# Altium schematic sheet MCUs.SchDoc
size B; Organization: ORGANIZATION; Address1: ADDRESS 1; Address2: ADDRESS 2; Address3: ADDRESS 3; Address4: ADDRESS 4; Revision: -; SheetNumber: 2; SheetTotal: 7; ENG_APP_DATE: --/--/--; DSN_APP_DATE: --/--/--; CHK_APP_DATE: --/--/--
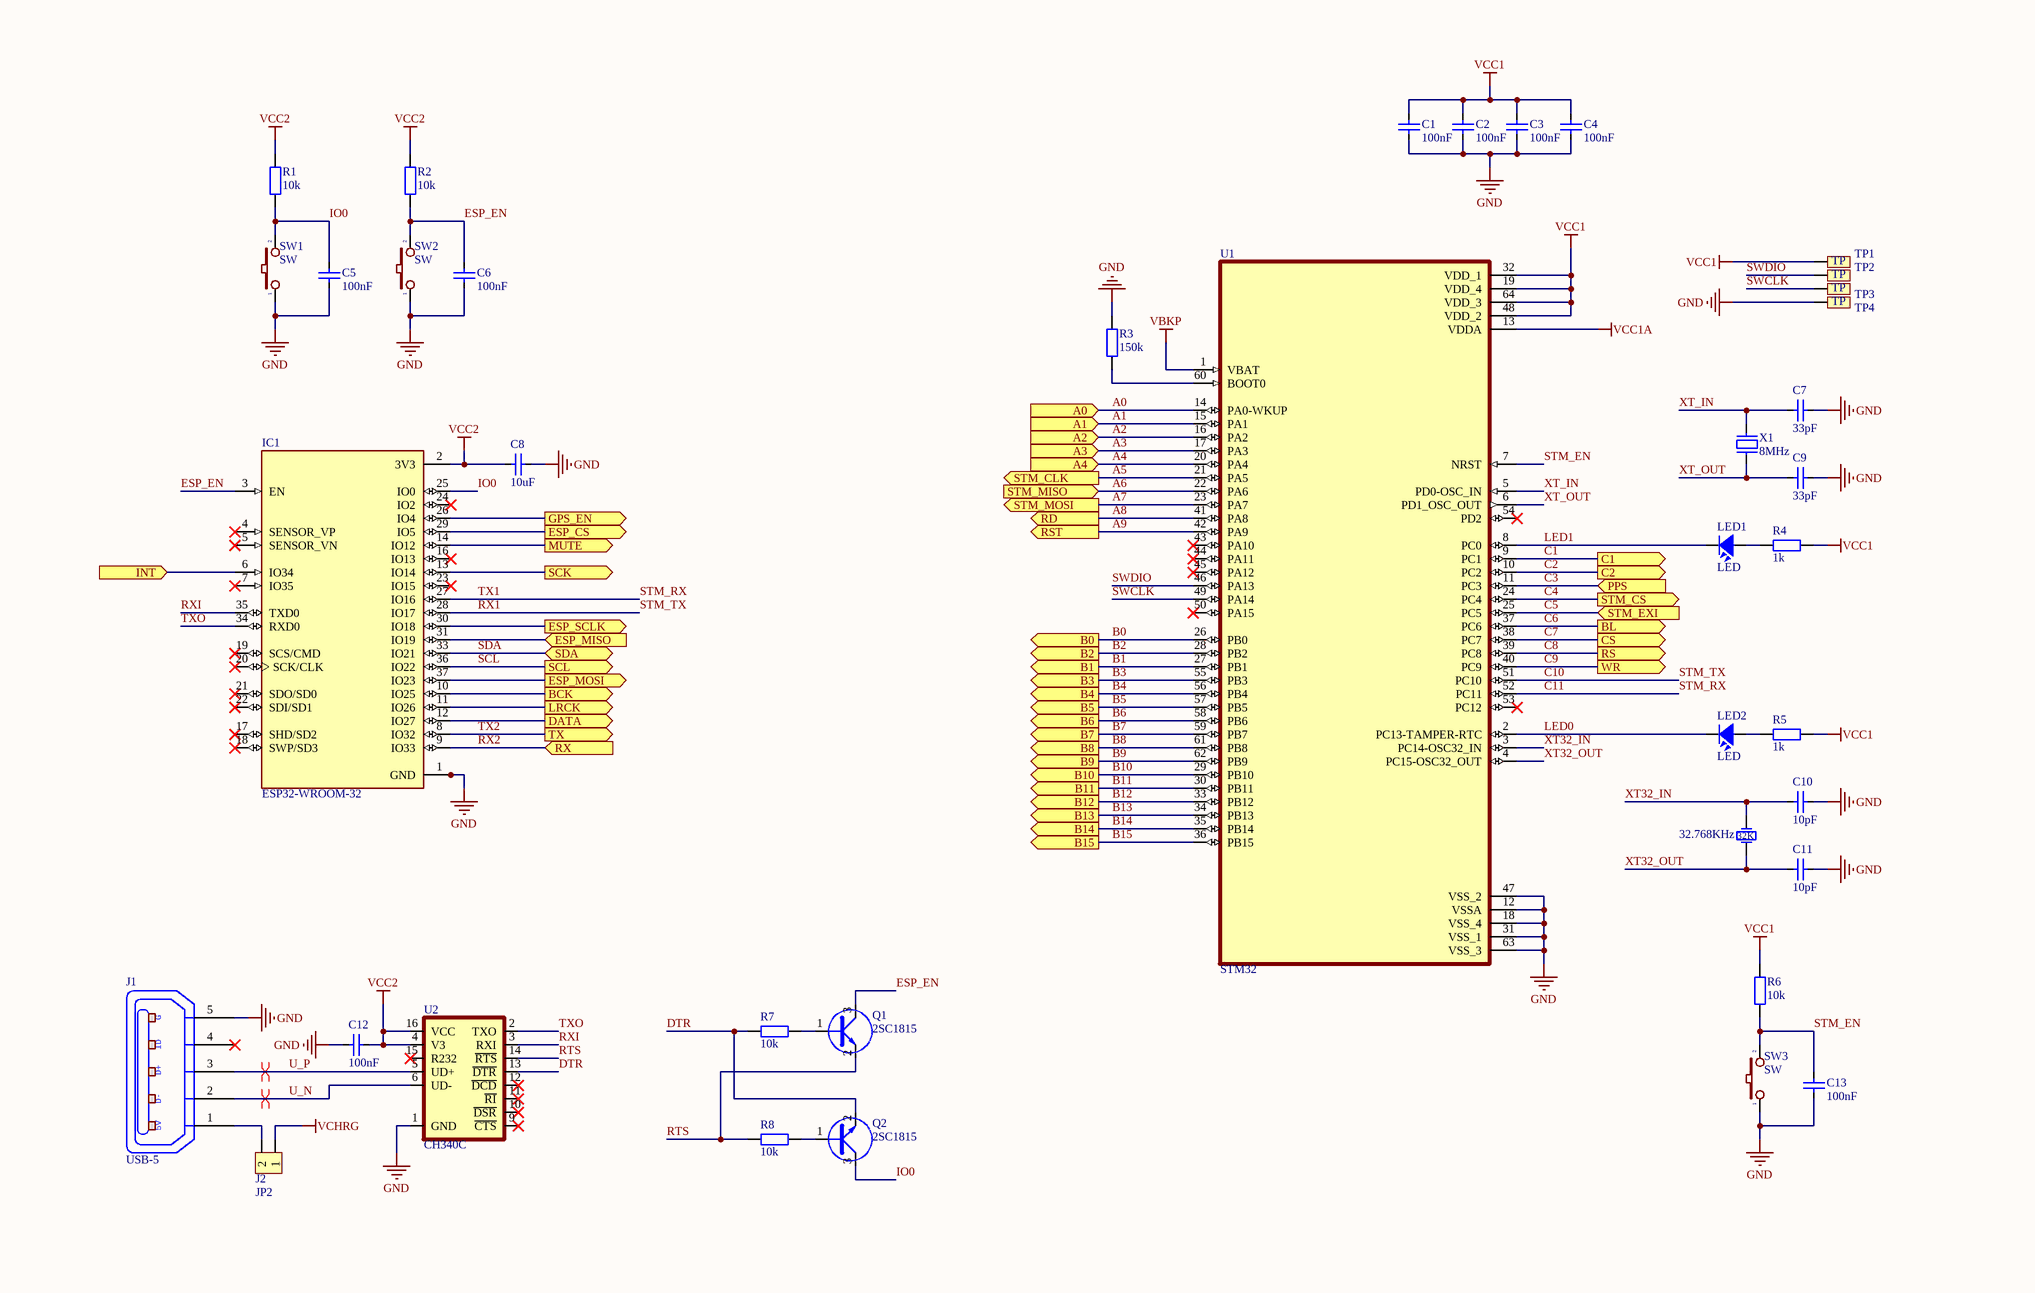
[diagram p0: MCUs.SchDoc]

## Parts
C1  100nF  [CAP_0603]
C2  100nF  [CAP_0603]
C3  100nF  [CAP_0603]
C4  100nF  [CAP_0603]
C5  100nF  [CAP_0603]
C6  100nF  [CAP_0603]
C7  33pF  [CAP_0603]
C8  10uF  [CAP_0603]
C9  33pF  [CAP_0603]
C10  10pF  [CAP_0603]
C11  10pF  [CAP_0603]
C12  100nF  [CAP_0603]
C13  100nF  [CAP_0603]
IC1  ESP32-WROOM-32  [MODULE_ESP32-WROOM-32]
J1  USB-5  [USB-M1]
J2  JP2  [JP2-CLOSED]
LED1  LED  [LED-0805-Blue]
LED2  LED  [LED-0805-Green]
Q1  2SC1815  [SOT23D]
Q2  2SC1815  [SOT23D]
R1  10k  [RES-SMD-0603]
R2  10k  [RES-SMD-0603]
R3  150k  [RES-SMD-0603]
R4  1k  [RES-SMD-0603]
R5  1k  [RES-SMD-0603]
R6  10k  [RES-SMD-0603]
R7  10k  [RES-SMD-0603]
R8  10k  [RES-SMD-0603]
SW1  SW  [SW 3x2x4]
SW2  SW  [SW 3x2x4]
SW3  SW  [SW 3x2x4]
TP1  TP  [TP_SMD]  (value not drawn)
TP2  TP  [TP_SMD]  (value not drawn)
TP3  TP  [TP_SMD]  (value not drawn)
TP4  TP  [TP_SMD]  (value not drawn)
U1  STM32  [LQFP 64]
U2  CH340C  [SOP-16]
X1  8MHz  [XT2]
Y1  32.768KHz  [XTAL32K]

## Ports
A0 (in), A1 (in), A2 (in), A3 (in), A4 (in), B0 (out), B1 (out), B2 (out), B3 (out), B4 (out), B5 (out), B6 (out), B7 (out), B8 (out), B9 (out), B10 (out), B11 (out), B12 (out), B13 (out), B14 (out), B15 (out), BCK (out), BL (out), C1 (out), C2 (out), CS (out), DATA (out), ESP_CS (out), ESP_MISO (in), ESP_MOSI (out), ESP_SCLK (out), GPS_EN (out), INT (in), LRCK (out), MUTE (out), PPS (in), RD (out), RS (out), RST (out), RX (in), SCK (out), SCL (out), SDA (bidir), STM_CLK (out), STM_CS (out), STM_EXI (in), STM_MISO (in), STM_MOSI (out), TX (out), WR (out)

## Nets
GND: C1.2 C2.2 C3.2 C4.2 C5.2 C6.2 C7.1 C8.2 C9.1 C10.1 C11.1 C12.1 C13.2 IC1.1(GND) IC1.15(GND) IC1.38(GND) IC1.39_1(GND) IC1.39_2(GND) IC1.39_3(GND) IC1.39_4(GND) IC1.39_5(GND) IC1.39_6(GND) IC1.39_7(GND) IC1.39_8(GND) IC1.39_9(GND) IC1.39_10(GND) IC1.39_11(GND) IC1.39_12(GND) IC1.39_13(GND) IC1.39_14(GND) IC1.39_15(GND) IC1.39_16(GND) IC1.39_17(GND) IC1.39_18(GND) IC1.39_19(GND) IC1.39_20(GND) IC1.39_21(GND) J1.5(P5) R3.1 SW1.1 SW2.1 SW3.1 TP4.1 U1.12(VSSA) U1.18(VSS_4) U1.31(VSS_1) U1.47(VSS_2) U1.63(VSS_3) U2.1(GND)
VBKP: U1.1(VBAT)
VCC1: C1.1 C2.1 C3.1 C4.1 R4.1 R5.1 R6.2 TP1.1 U1.19(VDD_4) U1.32(VDD_1) U1.48(VDD_2) U1.64(VDD_3)
VCC1A: U1.13(VDDA)
VCC2: C8.1 C12.2 IC1.2(3V3) R1.2 R2.2 U2.4(V3) U2.16(VCC)
VCHRG: J2.1
A0: U1.14(PA0-WKUP) ; port A0
A1: U1.15(PA1) ; port A1
A2: U1.16(PA2) ; port A2
A3: U1.17(PA3) ; port A3
A4: U1.20(PA4) ; port A4
A5: U1.21(PA5) ; port STM_CLK
A6: U1.22(PA6) ; port STM_MISO
A7: U1.23(PA7) ; port STM_MOSI
A8: U1.41(PA8) ; port RD
A9: U1.42(PA9) ; port RST
B0: U1.26(PB0) ; port B0
B1: U1.27(PB1) ; port B1
B2: U1.28(PB2) ; port B2
B3: U1.55(PB3) ; port B3
B4: U1.56(PB4) ; port B4
B5: U1.57(PB5) ; port B5
B6: U1.58(PB6) ; port B6
B7: U1.59(PB7) ; port B7
B8: U1.61(PB8) ; port B8
B9: U1.62(PB9) ; port B9
B10: U1.29(PB10) ; port B10
B11: U1.30(PB11) ; port B11
B12: U1.33(PB12) ; port B12
B13: U1.34(PB13) ; port B13
B14: U1.35(PB14) ; port B14
B15: U1.36(PB15) ; port B15
BCK: IC1.10(IO25) ; port BCK
C1: U1.9(PC1) ; port C1
C2: U1.10(PC2) ; port C2
C3: U1.11(PC3) ; port PPS
C4: U1.24(PC4) ; port STM_CS
C5: U1.25(PC5) ; port STM_EXI
C6: U1.37(PC6) ; port BL
C7: U1.38(PC7) ; port CS
C8: U1.39(PC8) ; port RS
C9: U1.40(PC9) ; port WR
C10: IC1.28(IO17) U1.51(PC10)  [also labelled RX1, STM_TX]
C11: IC1.27(IO16) U1.52(PC11)  [also labelled STM_RX, TX1]
DATA: IC1.12(IO27) ; port DATA
DTR: Q2.2(E) R7.2 U2.13(~{DTR})
ESP_CS: IC1.29(IO5) ; port ESP_CS
ESP_EN: C6.1 IC1.3(EN) Q1.3(C) R2.1 SW2.2
ESP_MISO: IC1.31(IO19) ; port ESP_MISO
ESP_MOSI: IC1.37(IO23) ; port ESP_MOSI
ESP_SCLK: IC1.30(IO18) ; port ESP_SCLK
GPS_EN: IC1.26(IO4) ; port GPS_EN
INT: IC1.6(IO34) ; port INT
IO0: C5.1 IC1.25(IO0) Q2.3(C) R1.1 SW1.2
LED0: LED2.2 U1.2(PC13-TAMPER-RTC)
LED1: LED1.2 U1.8(PC0)
LRCK: IC1.11(IO26) ; port LRCK
MUTE: IC1.14(IO12) ; port MUTE
RTS: Q1.2(E) R8.2 U2.14(~{RTS})
RX2: IC1.9(IO33) ; port RX
RXI: IC1.35(TXD0) U2.3(RXI)
SCK: IC1.13(IO14) ; port SCK
SCL: IC1.36(IO22) ; port SCL
SDA: IC1.33(IO21) ; port SDA
STM_EN: C13.1 R6.1 SW3.2 U1.7(NRST)
SWCLK: TP3.1 U1.49(PA14)
SWDIO: TP2.1 U1.46(PA13)
TX2: IC1.8(IO32) ; port TX
TXO: IC1.34(RXD0) U2.2(TXO)
U_N: J1.2(P2) U2.6(UD-)
U_P: J1.3(P3) U2.5(UD+)
XT32_IN: C10.2 U1.3(PC14-OSC32_IN) Y1.1(OSC1)
XT32_OUT: C11.2 U1.4(PC15-OSC32_OUT) Y1.2(OSC2)
XT_IN: C7.2 U1.5(PD0-OSC_IN) X1.2
XT_OUT: C9.2 U1.6(PD1_OSC_OUT) X1.1
NetJ1_1: J1.1(P1) J2.2
NetLED1_1: LED1.1 R4.2
NetLED2_1: LED2.1 R5.2
NetQ1_1: Q1.1(B) R7.1
NetQ2_1: Q2.1(B) R8.1
NetR3_2: R3.2 U1.60(BOOT0)

Not connected (* = marked no-connect by the designer): IC1 4(SENSOR_VP)* 5(SENSOR_VN)* 7(IO35)* 16(IO13)* 17(SHD/SD2)* 18(SWP/SD3)* 19(SCS/CMD)* 20(SCK/CLK)* 21(SDO/SD0)* 22(SDI/SD1)* 23(IO15)* 24(IO2)*; J1 4(P4)*; U1 43(PA10)* 44(PA11)* 45(PA12)* 50(PA15)* 53(PC12)* 54(PD2)*; U2 9(~{CTS})* 10(~{DSR})* 11(~{RI})* 12(~{DCD})* 15(R232)*

## Layout directives
differential pair: U_N, U_P

## Notes on the sheet
- DWG. NO.
- REV.
- SHT.
- THIS DOCUMENT AND THE DATA DISCLOSED HEREIN OR HEREWITH IS THE PROPERTY OF ALTIUM LIMITED AND MAY BE FREELY DISTRIBUTED IN WHOLE. NO RIGHTS ARE RESERVED OR EXPRESS OR IMPLIED WARANTEE GIVEN.
- REVISION
- DESCRIPTION
- DATE
- APPROVED
- ENG:
- APPROVALS
- PROJECT
- DSN:
- CHK:
- REFERENCE DOCUMENTS
- PROJECT REVISION:
- TITLE
- DOCUMENT REVISION:
- DESIGN ITEM:
- BOM:
- FAB DWG:
- PCB DWG:
- ASSY DWG:
- SCALE:
- SIZE
- B
- CAGE CODE
- FILE NAME
- DWG NO.
- SHEET
- OF
- REV
- (in symbol USB-5) G; ID; D+; D-; 5V
- (in symbol XTAL/32KHz) 32K

## Library data of the parts
C1-C13 = CapSMD: Capacitor; Value: 33p; Published: 8-Jun-2000; LatestRevisionDate: 17-Jul-2002; LatestRevisionNote: Re-released for DXP Platform.; PackageReference: RAD-0.3; Publisher: Altium Limited
IC1 = ESP32-WROOM-32: Bluetooth, WiFi Transceiver Module 2.4GHz ~ 2.5GHz Surface Mount; MF: Espressif Systems; Package: Module Espressif Systems; Digi-Key_Part_Number: 1904-1010-1-ND; Digi-Key_Purchase_URL: https://www.digikey.com/product-detail/en/espressif-systems/ESP32-WROOM-32/1904-1010-1-ND/8544305?utm_source=snapeda&utm_medium=aggregator&utm_campaign=symbol; Value: *; MP: ESP32-WROOM-32; SnapEDA_Link: https://www.snapeda.com/parts/ESP32-WROOM-32/Espressif%20Systems/view-part/2753322/?ref=snap
J1 = USB-5: Manufacturer: FCI; Manufacturer Part Number: 10118193-0001LF; Connector Type: USB - micro B; Number of Contacts: 5; Gender: Receptacle; Specifications: USB 2.0; .Creator: MM; .Checked PCB: RF; Supplier 1: Digi-Key; RoHS: RoHS Compliant; Category: Connectors, Interconnects; Stock 1: 28642; Pricing 1: 1=0.46, 10=0.433, 25=0.3712, 50=0.3156, 100=0.3032, 250=0.27224, 500=0.25988 (USD); Packaging: Cut Tape (CT); Mounting Type: Surface Mount, Right Angle, Horizontal; Features: Shielded, Solder Retention; Ingress Protection: -; ComponentLink1URL: http://portal.fciconnect.com/Comergent//fci/drawing/10118193.pdf; ComponentLink1Description: http://portal.fciconnect.com/Comergent//fci/drawing/10118193.pdf; Supplier Part Number 1: 609-4616-1-ND; .Checked SCH: MM
J2 = JP2: WR-PHD 2.54 mm Angled Socket Header; Manufacturer: W¨¹rth Elektronik eiSos GmbH; partNo: 613002143121; ComponentLink1 Description: Manufacturer; ComponentLink2 Description: Datasheet; NoPins: 02; Created Date: 29 March 2013; ComponentLink1URL: http://www.we-online.com; ComponentLink2URL: http://katalog.we-online.de/em/datasheet/6130xx143121.pdf; Created by: Karrer Zheng
LED1 LED2 = LED: LED Single colour Green and Red; Value: LED 3 ly Single Colour
Q1 Q2 = C1815: NPN 600mW, ECB; Value: C1815
R1-R8 = Resistor - SMD: Resistor SMD; Manufacturer: Generic Components; Class: Passive; Published: 08/06/2000; Publisher: Altium Hobart Technology Centre
SW1-SW3 = SW2: Switch button 2 pin; Value: SW chip 2 pin
TP1-TP4 = TP: CONNECT 1
U1 = STM32F103RCT6: STM32 ARM-based 32-bit MCU 72MHz 256KB
U2 = CH340C: USB to serial chip CH340; MF: WCH; Package: Package; Check_prices: https://www.snapeda.com/parts/CH340C/WCH/view-part/5428851/?ref=eda; Value: *; Price: None; MP: CH340C; Availability: Unavailable; SnapEDA_Link: https://www.snapeda.com/parts/CH340C/WCH/view-part/5428851/?ref=snap
X1 = XT2: Crystal For all Crystal 2pin.; Value: 4Mhz
Y1 = XTAL/32KHz: Crystal Oscillator; Published: 8-Jun-2000; LatestRevisionDate: 17-Jul-2002; LatestRevisionNote: Re-released for DXP Platform.; PackageReference: R38; Publisher: Altium Limited